# EAGLE schematic RodOfCommand (EAGLE 6.3)
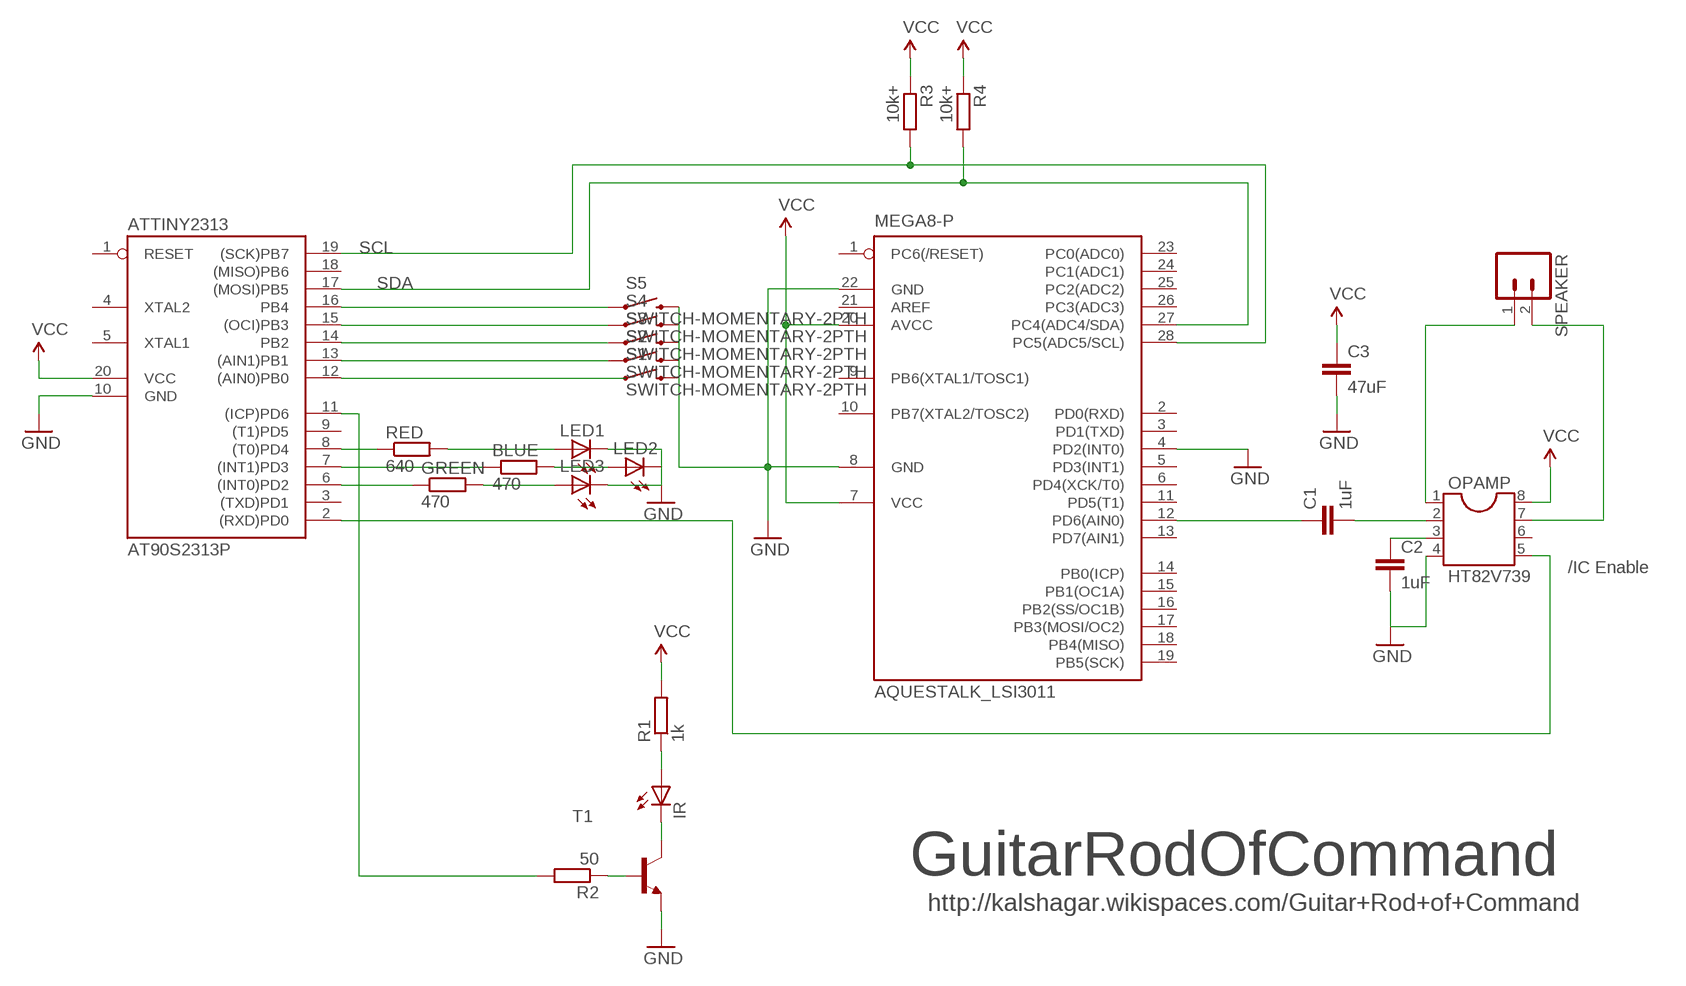
[diagram p0: schematic, sheet 1]

## Parts
AQUESTALK_LSI3011  MEGA8-P  [DIL28-3]
ATTINY2313  AT90S2313P  [DIL20]
BLUE  470  R-EU_0204/5  [0204/5]
C1  1uF  C-EU025-024X044  [C025-024X044]
C2  1uF  C-EU025-024X044  [C025-024X044]
C3  47uF  C-EU025-024X044  [C025-024X044]
GREEN  470  R-EU_0204/5  [0204/5]
IR  LED5MM  [LED5MM]
LED1  LED-3MM-NO_SILK  [LED3MM-NS]
LED2  LED-3MM-NO_SILK  [LED3MM-NS]
LED3  LED-3MM-NO_SILK  [LED3MM-NS]
OPAMP  HT82V739  DIL8  [DIL08]
R1  1k  R-EU_0204/7  [0204/7]
R2  50  R-EU_0204/7  [0204/7]
R3  10k+  R-EU_0204/7  [0204/7]
R4  10k+  R-EU_0204/7  [0204/7]
RED  640  R-EU_0204/5  [0204/5]
S1  SWITCH-MOMENTARY-2PTH  [TACTILE-PTH]
S2  SWITCH-MOMENTARY-2PTH  [TACTILE-PTH]
S3  SWITCH-MOMENTARY-2PTH  [TACTILE-PTH]
S4  SWITCH-MOMENTARY-2PTH  [TACTILE-PTH]
S5  SWITCH-MOMENTARY-2PTH  [TACTILE-PTH]
SPEAKER  M02LOCK  [1X02_LOCK]
T1  -NPN-TO92-ECB  [TO92-ECB]

## Nets
GND: AQUESTALK_LSI3011.4(PD2(INT0)) AQUESTALK_LSI3011.8(GND) AQUESTALK_LSI3011.22(GND) ATTINY2313.10(GND) C2.2 C3.2 LED1.K(C) LED2.K(C) LED3.K(C) OPAMP.4 S1.3 S2.3 S3.3 S4.3 S5.3 T1.E
N$1: IR.A R1.1
N$2: IR.K(C) T1.C
N$3: R2.1 T1.B
N$4: ATTINY2313.11((ICP)PD6) R2.2
N$5: AQUESTALK_LSI3011.27(PC4(ADC4/SDA)) ATTINY2313.17((MOSI)PB5) R4.2
N$6: AQUESTALK_LSI3011.28(PC5(ADC5/SCL)) ATTINY2313.19((SCK)PB7) R3.2
N$7: AQUESTALK_LSI3011.12(PD6(AIN0)) C1.1
N$8: C1.2 OPAMP.2
N$9: C2.1 OPAMP.3
N$10: ATTINY2313.2((RXD)PD0) OPAMP.5
N$11: OPAMP.1 SPEAKER.1
N$12: OPAMP.7 SPEAKER.2
N$13: ATTINY2313.8((T0)PD4) RED.1
N$14: ATTINY2313.16(PB4) S5.1
N$15: ATTINY2313.15((OCI)PB3) S4.1
N$16: ATTINY2313.14(PB2) S3.1
N$17: ATTINY2313.13((AIN1)PB1) S2.1
N$18: ATTINY2313.12((AIN0)PB0)
N$19: ATTINY2313.7((INT1)PD3) BLUE.1
N$20: ATTINY2313.6((INT0)PD2) GREEN.1
N$21: LED1.A RED.2
N$22: BLUE.2 LED2.A
N$23: GREEN.2 LED3.A
VCC: AQUESTALK_LSI3011.7(VCC) AQUESTALK_LSI3011.20(AVCC) ATTINY2313.20(VCC) C3.1 OPAMP.8 R1.2 R3.1 R4.1
Unconnected: AQUESTALK_LSI3011.1(PC6(/RESET)) AQUESTALK_LSI3011.2(PD0(RXD)) AQUESTALK_LSI3011.3(PD1(TXD)) AQUESTALK_LSI3011.5(PD3(INT1)) AQUESTALK_LSI3011.6(PD4(XCK/T0)) AQUESTALK_LSI3011.9(PB6(XTAL1/TOSC1)) AQUESTALK_LSI3011.10(PB7(XTAL2/TOSC2)) AQUESTALK_LSI3011.11(PD5(T1)) AQUESTALK_LSI3011.13(PD7(AIN1)) AQUESTALK_LSI3011.14(PB0(ICP)) AQUESTALK_LSI3011.15(PB1(OC1A)) AQUESTALK_LSI3011.16(PB2(SS/OC1B)) AQUESTALK_LSI3011.17(PB3(MOSI/OC2)) AQUESTALK_LSI3011.18(PB4(MISO)) AQUESTALK_LSI3011.19(PB5(SCK)) AQUESTALK_LSI3011.21(AREF) AQUESTALK_LSI3011.23(PC0(ADC0)) AQUESTALK_LSI3011.24(PC1(ADC1)) AQUESTALK_LSI3011.25(PC2(ADC2)) AQUESTALK_LSI3011.26(PC3(ADC3)) ATTINY2313.1(RESET) ATTINY2313.3((TXD)PD1) ATTINY2313.4(XTAL2) ATTINY2313.5(XTAL1) ATTINY2313.9((T1)PD5) ATTINY2313.18((MISO)PB6) OPAMP.6 S1.1

## Notes on the sheet
- SCL
- SDA
- /IC Enable
- GuitarRodOfCommand
- http://kalshagar.wikispaces.com/Guitar+Rod+of+Command

## Library data of the parts
AQUESTALK_LSI3011 = atmel:MEGA8-P: MICROCONTROLLER 8 Kbytes FLASH, 1 kbytes SRAM, 512 bytes EEPROM, USART, 4-channel 10 bit ADC, 2-channel 8 bit ADC Pin compatible with Atmega48, ATMega88, ATMega168 Source: avr.lbr; OC_FARNELL: unknown; OC_NEWARK: unknown
ATTINY2313 = atmel:AT90S2313: MICROCONTROLLER 2 Kbytes FLASH 128 bytes SRAM 128 bytes EEPROM UART; OC_FARNELL: unknown; OC_NEWARK: unknown
BLUE GREEN R1-R4 RED = resistor:R-EU_: RESISTOR, European symbol
C1-C3 = resistor:C-EU: CAPACITOR, European symbol
IR LED1-LED3 = SparkFun-LED:LED: LEDs Standard schematic elements and footprints for 5mm, 3mm, 1206, and 0603 sized LEDs. 5mm - Spark Fun Electronics SKU : COM-00529 (and others)
OPAMP = ic-package:DIL8: Dual In Line / Socket
S1-S5 = SparkFun-Electromechanical:SWITCH-MOMENTARY-2: Various NO switches- pushbuttons, reed, etc
SPEAKER = SparkFun-Connectors:M02: Header 2 Standard 2-pin 0.1" header. Use with straight break away headers (SKU : PRT-00116), right angle break away headers (PRT-00553), swiss pins (PRT-00743), machine pins (PRT-00117), and female headers (PRT-00115). Molex polarized connector foot print use with SKU : PRT-08233 with associated crimp pins and housings.
T1 = transistor:*-NPN-: NPN Transistror BF959 corrected 2008.03.06